# Altium schematic sheet analog_mics.SchDoc
size A4; SheetNumber: 7; SheetTotal: 8
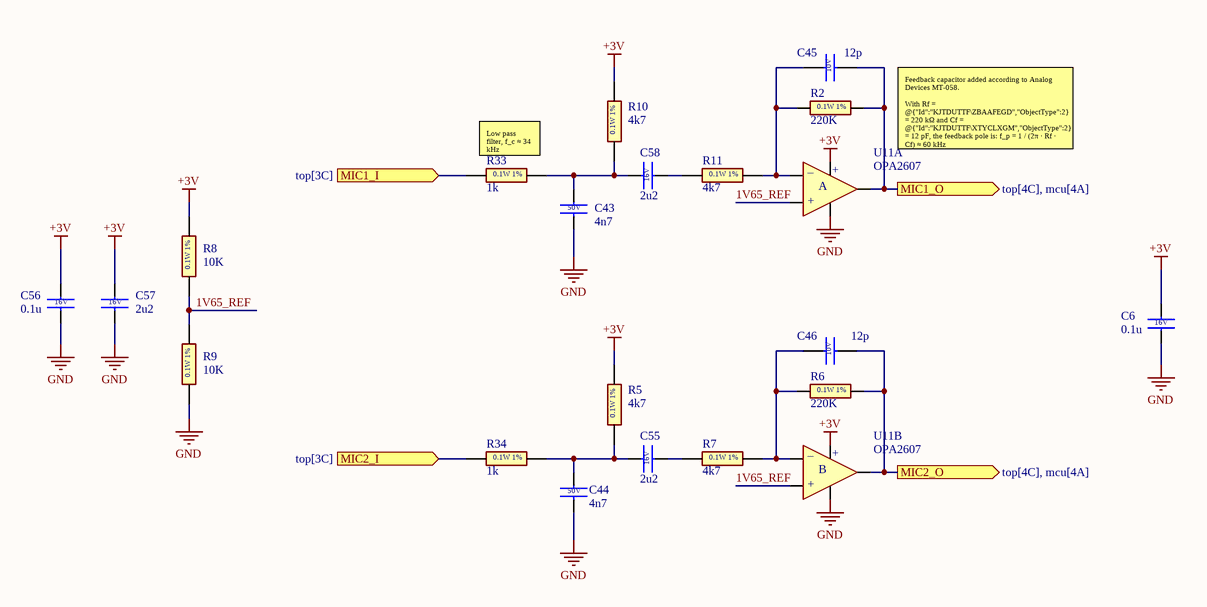
[diagram p0: analog_mics.SchDoc]

## Parts
C6  0.1u  [CAPC1608X95N]
C43  4n7  [C0603]
C44  4n7  [C0603]
C45  12p  [CAPC1608X97N]
C46  12p  [CAPC1608X97N]
C55  2u2  [CAPC1608X90N]
C56  0.1u  [CAPC1608X95N]
C57  2u2  [CAPC1608X90N]
C58  2u2  [CAPC1608X90N]
R2  220K  [RESC1608X55N]
R5  4k7  [RESC1608X50N]
R6  220K  [RESC1608X55N]
R7  4k7  [RESC1608X50N]
R8  10K  [RESC1608X50N]
R9  10K  [RESC1608X50N]
R10  4k7  [RESC1608X50N]
R11  4k7  [RESC1608X50N]
R33  1k  [RESC1608X50N]
R34  1k  [RESC1608X50N]
U11  OPA2607  [SOIC127P600X175-8N]  (parts A,B of 2)

## Ports
MIC1_I (in, see top[3C]), MIC1_O (out, see top[4C], mcu[4A]), MIC2_I (in, see top[3C]), MIC2_O (out, see top[4C], mcu[4A])

## Nets
+3V: C6.1 C56.1 C57.1 R5.2 R8.2 R10.2 U11.8(VS+)
GND: C6.2 C43.2 C44.2 C56.2 C57.2 R9.1 U11.4(VS-)
1V65_REF: R8.1 R9.2 U11.3(IN1+) U11.5(IN2+)
MIC1_I: R33.1 ; port MIC1_I
MIC1_O: C45.2 R2.2 U11.1(OUT1) ; port MIC1_O
MIC2_I: R34.1 ; port MIC2_I
MIC2_O: C46.2 R6.2 U11.7(OUT2) ; port MIC2_O
NetC43_1: C43.1 C58.1 R10.1 R33.2
NetC44_1: C44.1 C55.1 R5.1 R34.2
NetC45_1: C45.1 R2.1 R11.2 U11.2(IN1-)
NetC46_1: C46.1 R6.1 R7.2 U11.6(IN2-)
NetC55_2: C55.2 R7.1
NetC58_2: C58.2 R11.1

## Notes on the sheet
- (near R33) Low pass filter, f_c ≈ 34 kHz
- Feedback capacitor added according to Analog Devices MT-058.
  With Rf = @{"Id":"KJTDUTTF\ZBAAFEGD","ObjectType":2} = 220 kΩ and Cf = @{"Id":"KJTDUTTF\XTYCLXGM","ObjectType":2} = 12 pF, the feedback pole is: f_p = 1 / (2π · Rf · Cf) ≈ 60 kHz
  This limits high-frequency gain and helps improve stability / RF noise immunity.
- Název výkresu /drawing title/:
- Název souboru /sheet name/:
- Varianta /variant/:
- Organizace /organisation/:
- ČVUT FEL
- Kreslil /drawn by/:
- Datum /date/:
- Podpis /signature/:
- List /sheet/:
- Verze /version/:
- /
- (in symbol ECK+2.2u16V) 16V
- (in symbol ECK+4n750V) 50V
- (in symbol ECK+12p10V) 10V
- (in symbol ECK+100n16V) 16V
- (in symbol ER+1K) 0.1W 1%
- (in symbol ER+4k7) 0.1W 1%
- (in symbol ER+10K) 0.1W 1%
- (in symbol ER+220K) 0.1W 1%
- (in symbol EU+OPA2607IDR, part A) +; –; A
- (in symbol EU+OPA2607IDR, part B) +; –; B

## Library data of the parts
C6 C56 = ECK+100n16V: 16V 0.1uF XR7 0603 10%; Manufacturer_Name: KEMET; Manufacturer_Part_Number: C0603C104K4RAC-TU; Datasheet Link: https://connect.kemet.com:7667/gateway/IntelliData-ComponentDocumentation/1.0/download/specsheet/C0603C104K4RACTU; Height: 0.95mm; Mouser Part Number: 80-C0603C104K4RAC; Arrow Part Number: C0603C104K4RAC-TU; Arrow Price/Stock: https://www.arrow.com/en/products/c0603c104k4ractu/kemet-corporation
C43 C44 = ECK+4n750V: 50 VDC, 10 %, X7R; Manufacturer_Name: KEMET; Manufacturer_Part_Number: C0603C472K5RACTU; Datasheet Link: https://content.kemet.com/datasheets/KEM_C1002_X7R_SMD.pdf; Height: 0.87mm; Arrow Part Number: C0603C472K5RACTU; Arrow Price/Stock: https://www.arrow.com/en/products/c0603c472k5ractu/kemet-corporation?region=nac
C45 C46 = ECK+12p10V: Multilayer Ceramic Capacitors MLCC - SMD/SMT 0603 12pF 10volts C0G(N0P) 1%; Manufacturer_Name: Vishay; Manufacturer_Part_Number: VJ0603A120FXQCW1BC; Datasheet Link: https://www.vishay.com/docs/45199/vjcommercialseries.pdf; Height: 0.97mm; Mouser Part Number: 77-VJ0603A120FXQCBC; Mouser Price/Stock: https://www.mouser.com/Search/Refine.aspx?Keyword=77-VJ0603A120FXQCBC; Arrow Part Number: VJ0603A120FXQCW1BC; Arrow Price/Stock: https://www.arrow.com/en/products/vj0603a120fxqcw1bc/vishay
C55 C57 C58 = ECK+2.2u16V: Multilayer Ceramic Capacitors MLCC - SMD/SMT 2.2 uF 16 VDC 10% 0603 X6S; Manufacturer_Name: Murata Electronics; Manufacturer_Part_Number: GRM188C81C225KA12D; Datasheet Link: https://search.murata.co.jp/Ceramy/image/img/A01X/G101/ENG/GRM188C81C225KA12-04A.pdf; Height: 0.9mm; Mouser Part Number: 81-GRM188C81C225KA2D; Mouser Price/Stock: https://www.mouser.co.uk/ProductDetail/Murata-Electronics/GRM188C81C225KA12D?qs=O5cugoO6nwevZQeqg2lgHQ%3D%3D; Arrow Part Number: GRM188C81C225KA12D; Arrow Price/Stock: https://www.arrow.com/en/products/grm188c81c225ka12d/murata-manufacturing?utm_currency=USD&region=nac
R2 R6 = ER+220K: Thick Film Resistors - SMD 1/8 Watt 220Kohms 1%; Manufacturer_Name: Vishay; Manufacturer_Part_Number: CRCW0603220KFKEA; Datasheet Link: https://www.vishay.com/docs/20035/dcrcwe3.pdf; Height: 0.55mm; Mouser Part Number: 71-CRCW0603-220K-E3; Mouser Price/Stock: https://cz.mouser.com/ProductDetail/Vishay/CRCW0603220KFKEA?qs=pVi9qluBdEGy7pbAV1jqkQ%3D%3D
R5 R7 R10 R11 = ER+4k7: Resistor 1%, 0.1W; Manufacturer_Name: Vishay; Manufacturer_Part_Number: CRCW06034K70FKEAHP; Datasheet Link: http://www.farnell.com/datasheets/1885357.pdf; Height: 0.5mm; Mouser Part Number: 71-CRCW06034K70FKEAH; Mouser Price/Stock: https://www.mouser.co.uk/ProductDetail/Vishay-Dale/CRCW06034K70FKEAHP?qs=k2%2FDWSARqgF9tclCHvhGkQ%3D%3D; Arrow Part Number: CRCW06034K70FKEAHP; Arrow Price/Stock: https://www.arrow.com/en/products/crcw06034k70fkeahp/vishay?region=nac
R8 R9 = ER+10K: Resistor 1%, 0.1W; Manufacturer_Name: Vishay; Manufacturer_Part_Number: CRCW060310K0FKEA; Datasheet Link: http://www.vishay.com/docs/20035/dcrcwe3.pdf; Height: 0.5mm; Mouser Part Number: 71-CRCW0603-10K-E3; Mouser Price/Stock: https://www.mouser.co.uk/ProductDetail/Vishay-Dale/CRCW060310K0FKEA?qs=pAO1Z172M84BVnhDjtnsoQ%3D%3D; Arrow Part Number: CRCW060310K0FKEA; Arrow Price/Stock: https://www.arrow.com/en/products/crcw060310k0fkea/vishay?region=europe
R33 R34 = ER+1K: Resistor 1%, 0.1W; Manufacturer_Name: Vishay; Manufacturer_Part_Number: CRCW06031K00FKEA; Datasheet Link: http://www.vishay.com/docs/20035/dcrcwe3.pdf; Height: 0.5mm; Mouser Part Number: 71-CRCW0603-1.0K-E3; Mouser Price/Stock: https://www.mouser.co.uk/ProductDetail/Vishay-Dale/CRCW06031K00FKEA?qs=CToX950LohJasujQx7GY3g%3D%3D; Arrow Part Number: CRCW06031K00FKEA; Arrow Price/Stock: https://www.arrow.com/en/products/crcw06031k00fkea/vishay?region=europe
U11 = EU+OPA2607IDR: Operational Amplifiers - Op Amps Dual-channel low-po wer precision 50-M; Manufacturer_Name: Texas Instruments; Datasheet Link: https://www.ti.com/lit/ds/symlink/opa2607.pdf; Height: 1.75mm; Manufacturer_Part_Number: OPA2607IDR; Mouser Part Number: 595-OPA2607IDR; Mouser Price/Stock: https://www.mouser.co.uk/ProductDetail/Texas-Instruments/OPA2607IDR?qs=zW32dvEIR3ss%2FpWvIqcTXw%3D%3D; Arrow Part Number: OPA2607IDR; Arrow Price/Stock: https://www.arrow.com/en/products/opa2607idr/texas-instruments